# EAGLE design Small Whole House Power Meter STPM34 v0.6d routed (EAGLE 7.2.0)

## Sheet 1 of 2
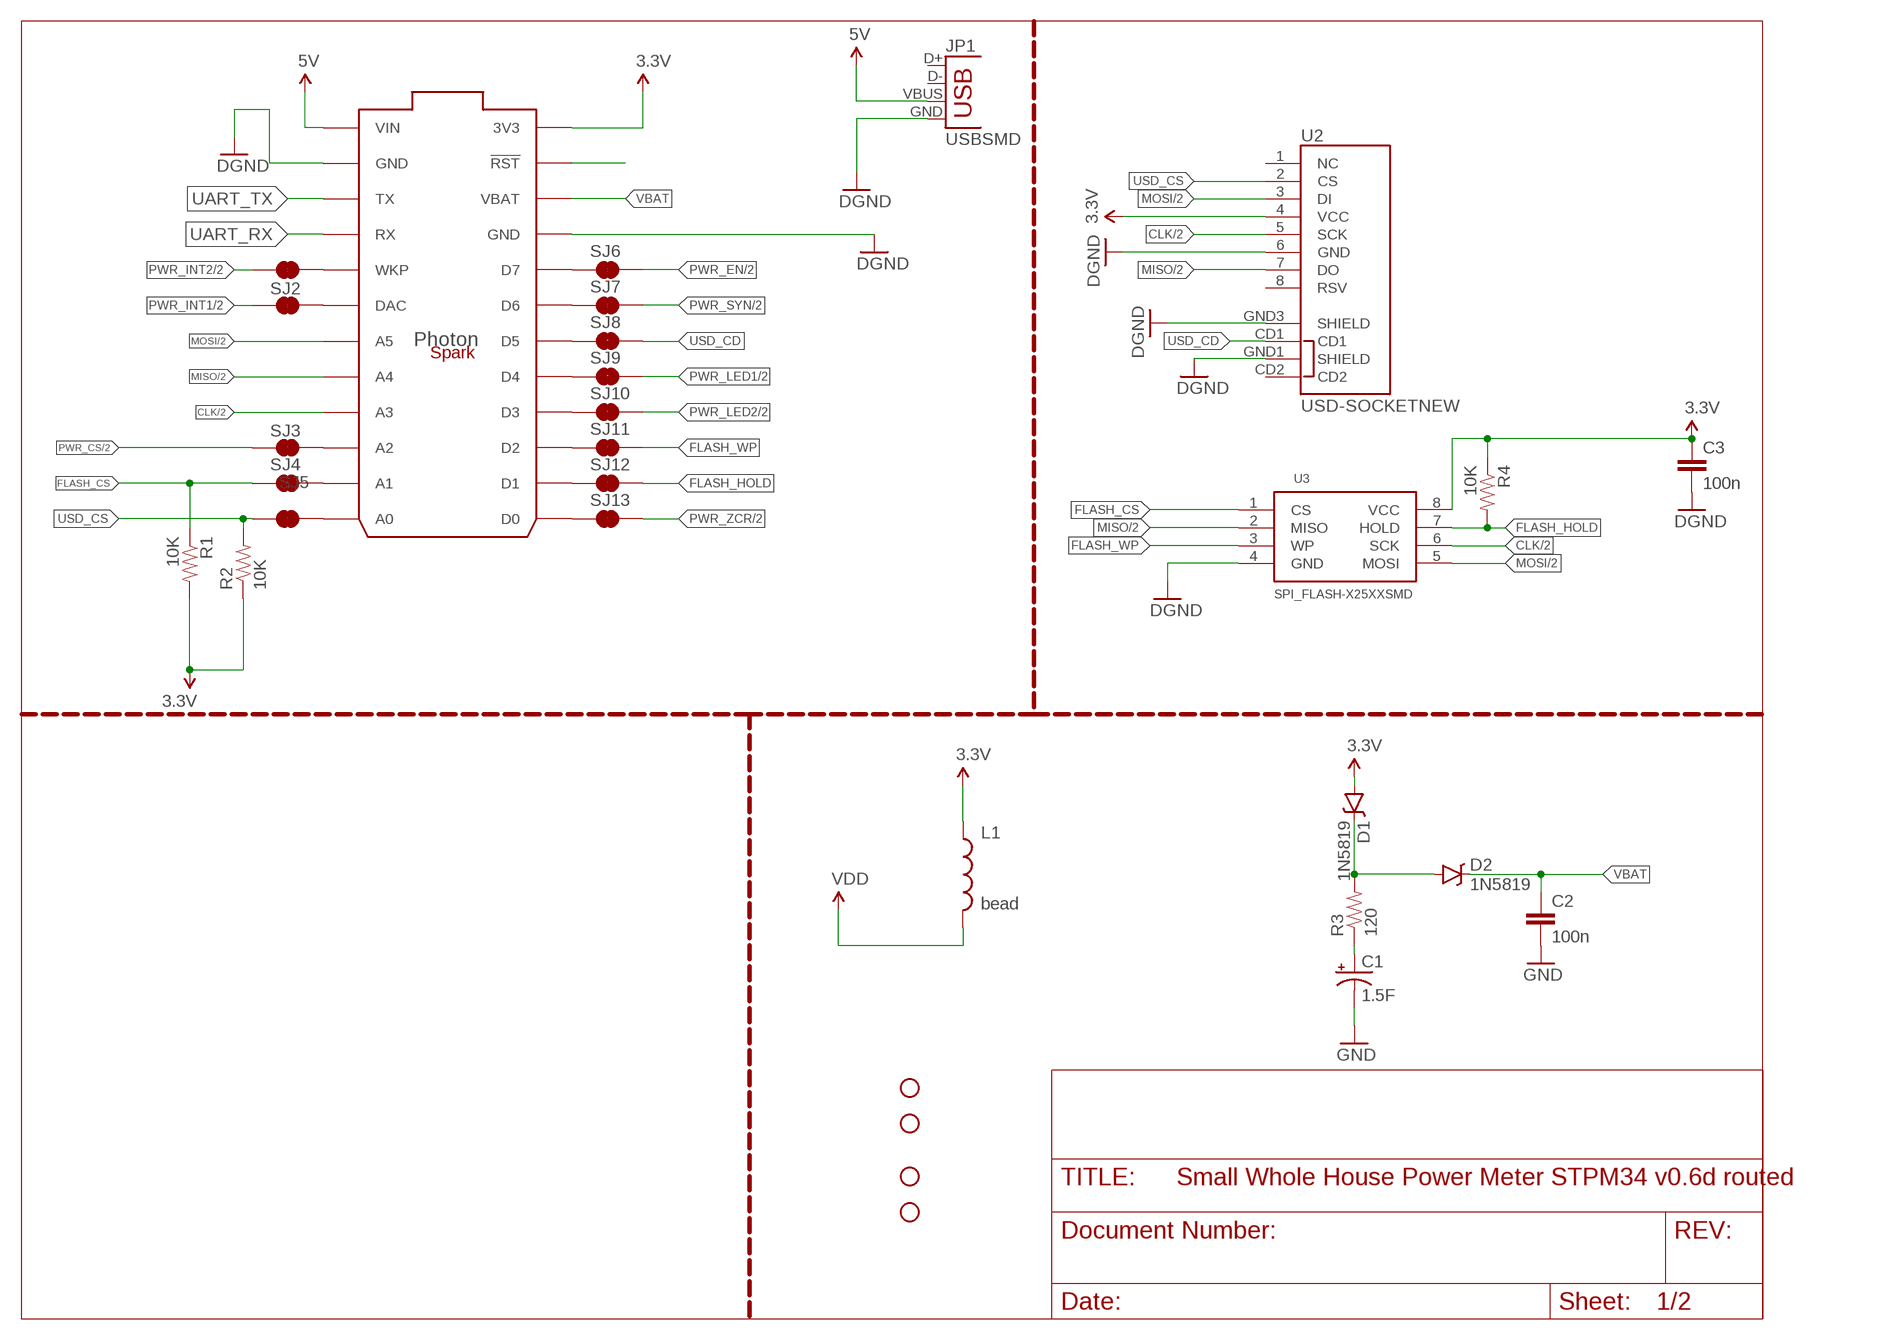
[diagram p0: schematic, sheet 1]

### Parts
C1  1.5F  CAP_POLSUPERHORIZ  [1.5SUPERCAPHORIZ]
C2  100n  CAP0603-CAP  [0603-CAP]
C3  100n  CAP0603-CAP  [0603-CAP]
D1  1N5819  DIODE-SCHOTTKY-SOD123  [SOD-123]
D2  1N5819  DIODE-SCHOTTKY-SOD123  [SOD-123]
JP1  USBSMD  [USB-MINIB]
L1  bead  INDUCTOR0603  [0603]
M1  SPARK_LOGO..  [SPARK_LOGO]
R1  10K  RESISTOR0603  [0603-RES]
R2  10K  RESISTOR0603  [0603-RES]
R3  120  RESISTOR0603  [0603-RES]
R4  10K  RESISTOR0603  [0603-RES]
SJ1  JUMPER-PAD-2-NC_BY_TRACE  [PAD-JUMPER-2-NC_BY_TRACE_YES_SILK]
SJ2  JUMPER-PAD-2-NC_BY_TRACE  [PAD-JUMPER-2-NC_BY_TRACE_YES_SILK]
SJ3  JUMPER-PAD-2-NC_BY_TRACE  [PAD-JUMPER-2-NC_BY_TRACE_YES_SILK]
SJ4  JUMPER-PAD-2-NC_BY_TRACE  [PAD-JUMPER-2-NC_BY_TRACE_YES_SILK]
SJ5  JUMPER-PAD-2-NC_BY_TRACE  [PAD-JUMPER-2-NC_BY_TRACE_YES_SILK]
SJ6  JUMPER-PAD-2-NC_BY_TRACE  [PAD-JUMPER-2-NC_BY_TRACE_YES_SILK]
SJ7  JUMPER-PAD-2-NC_BY_TRACE  [PAD-JUMPER-2-NC_BY_TRACE_YES_SILK]
SJ8  JUMPER-PAD-2-NC_BY_TRACE  [PAD-JUMPER-2-NC_BY_TRACE_YES_SILK]
SJ9  JUMPER-PAD-2-NC_BY_TRACE  [PAD-JUMPER-2-NC_BY_TRACE_YES_SILK]
SJ10  JUMPER-PAD-2-NC_BY_TRACE  [PAD-JUMPER-2-NC_BY_TRACE_YES_SILK]
SJ11  JUMPER-PAD-2-NC_BY_TRACE  [PAD-JUMPER-2-NC_BY_TRACE_YES_SILK]
SJ12  JUMPER-PAD-2-NC_BY_TRACE  [PAD-JUMPER-2-NC_BY_TRACE_YES_SILK]
SJ13  JUMPER-PAD-2-NC_BY_TRACE  [PAD-JUMPER-2-NC_BY_TRACE_YES_SILK]
STANDOFF1  STAND-OFF  [STAND-OFF]
STANDOFF2  STAND-OFF  [STAND-OFF]
STANDOFF3  STAND-OFF  [STAND-OFF]
STANDOFF4  STAND-OFF  [STAND-OFF]
U1  PHOTON_SMD_W_PINS  [PHOTON_SMD_W_PINS]
U2  USD-SOCKETNEW  [MICRO-SD-SOCKET-PP]
U3  SPI_FLASH-X25XXSMD  [SO08N/W]

### Nets
3.3V [Power]: C3.1 D1.A L1.1 R1.2 R2.1 R4.1 U1.1_24(3V3) U1.24(3V3) U1.24*(3V3) U1.24_(3V3) U2.4(VCC) U3.8(VCC)
5V [Power]: JP1.VBUS U1.1(VIN) U1.1*(VIN) U1.1_1(VIN) U1.1_(VIN)
CLK: U1.1_9(A3) U1.9(A3) U1.9*(A3) U1.9_(A3) U2.5(SCK) U3.6(SCK) ; also sheet 2
FLASH_CS: R1.1 SJ4.1 U3.1(CS)
FLASH_HOLD: R4.2 SJ12.2 U3.7(HOLD)
FLASH_WP: SJ11.2 U3.3(WP)
GND [Power]: C1.- C2.2 C3.2 JP1.GND U1.1_2(GND) U1.1_21(GND) U1.2(GND) U1.2*(GND) U1.2_(GND) U1.21(GND) U1.21*(GND) U1.21_(GND) U2.6(GND) U2.GND1(SHIELD) U2.GND3(SHIELD) U3.4(GND) ; supply symbol labelled DGND ; also sheet 2
MISO: U1.1_8(A4) U1.8(A4) U1.8*(A4) U1.8_(A4) U2.7(DO) U3.2(MISO) ; also sheet 2
MOSI: U1.1_7(A5) U1.7(A5) U1.7*(A5) U1.7_(A5) U2.3(DI) U3.5(MOSI) ; also sheet 2
N$3: SJ13.1 U1.1_13(D0) U1.13(D0) U1.13*(D0) U1.13_(D0)
N$20: U1.1_23(!RST) U1.23(!RST) U1.23*(!RST) U1.23_(!RST)
N$21 [Power]: C1.+ R3.1
N$22: SJ11.1 U1.1_15(D2) U1.15(D2) U1.15*(D2) U1.15_(D2)
N$23: SJ4.2 U1.1_11(A1) U1.11(A1) U1.11*(A1) U1.11_(A1)
N$25: SJ3.2 U1.1_10(A2) U1.10(A2) U1.10*(A2) U1.10_(A2)
N$27: SJ2.2 U1.1_6(DAC) U1.6(DAC) U1.6*(DAC) U1.6_(DAC)
N$28: SJ1.2 U1.1_5(WKP) U1.5(WKP) U1.5*(WKP) U1.5_(WKP)
N$29: SJ6.1 U1.1_20(D7) U1.20(D7) U1.20*(D7) U1.20_(D7)
N$30: SJ7.1 U1.1_19(D6) U1.19(D6) U1.19*(D6) U1.19_(D6)
N$31: SJ8.1 U1.1_18(D5) U1.18(D5) U1.18*(D5) U1.18_(D5)
N$32: SJ9.1 U1.1_17(D4) U1.17(D4) U1.17*(D4) U1.17_(D4)
N$34: SJ12.1 U1.1_14(D1) U1.14(D1) U1.14*(D1) U1.14_(D1)
N$35: SJ10.1 U1.1_16(D3) U1.16(D3) U1.16*(D3) U1.16_(D3)
N$37: D1.C D2.A R3.2
N$38: SJ5.2 U1.1_12(A0) U1.12(A0) U1.12*(A0) U1.12_(A0)
PWR_CS: SJ3.1 ; also sheet 2
PWR_EN: SJ6.2 ; also sheet 2
PWR_INT1: SJ2.1 ; also sheet 2
PWR_INT2: SJ1.1 ; also sheet 2
PWR_LED1: SJ9.2 ; also sheet 2
PWR_LED2: SJ10.2 ; also sheet 2
PWR_SYN: SJ7.2 ; also sheet 2
PWR_ZCR: SJ13.2 ; also sheet 2
UART_RX: U1.1_4(RX) U1.4(RX) U1.4*(RX) U1.4_(RX)
UART_TX: U1.1_3(TX) U1.3(TX) U1.3*(TX) U1.3_(TX)
USD_CD: SJ8.2 U2.CD1
USD_CS: R2.2 SJ5.1 U2.2(CS)
VBAT: C2.1 D2.C U1.1_22(VBAT) U1.22(VBAT) U1.22*(VBAT) U1.22_(VBAT)
VDD [Power]: L1.2 ; also sheet 2
Unconnected: JP1.D+ JP1.D- U2.1(NC) U2.8(RSV) U2.CD2

## Sheet 2 of 2
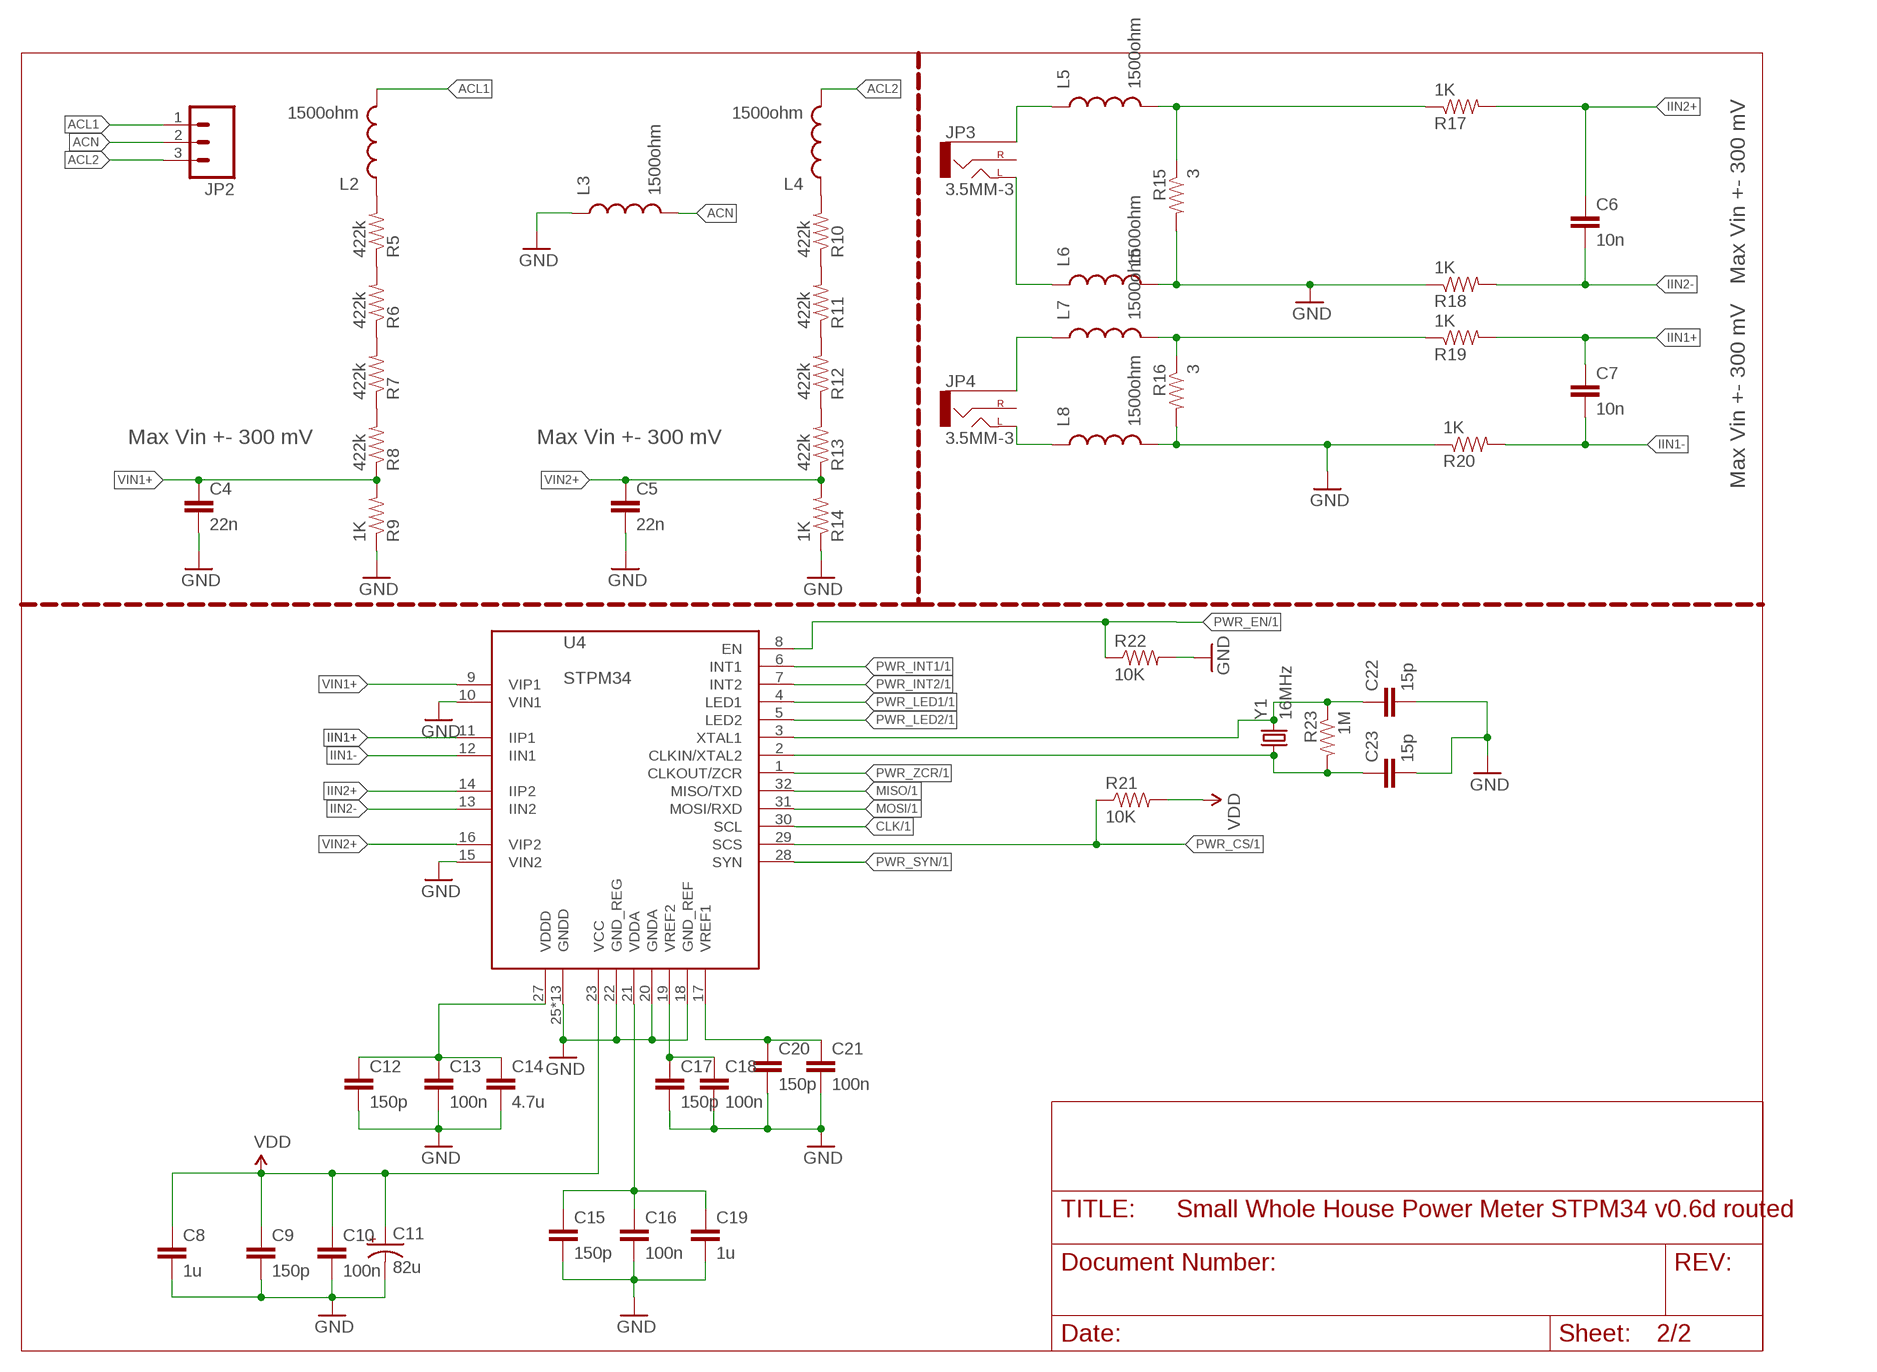
[diagram p1: schematic, sheet 2]

### Parts
C4  22n  CAP0603-CAP  [0603-CAP]
C5  22n  CAP0603-CAP  [0603-CAP]
C6  10n  CAP0603-CAP  [0603-CAP]
C7  10n  CAP0603-CAP  [0603-CAP]
C8  1u  CAP0603-CAP  [0603-CAP]
C9  150p  CAP0603-CAP  [0603-CAP]
C10  100n  CAP0603-CAP  [0603-CAP]
C11  82u  CAP_POLPTH2  [CPOL-RADIAL-10UF-25V]
C12  150p  CAP0603-CAP  [0603-CAP]
C13  100n  CAP0603-CAP  [0603-CAP]
C14  4.7u  CAP0805  [0805]
C15  150p  CAP0603-CAP  [0603-CAP]
C16  100n  CAP0603-CAP  [0603-CAP]
C17  150p  CAP0603-CAP  [0603-CAP]
C18  100n  CAP0603-CAP  [0603-CAP]
C19  1u  CAP0603-CAP  [0603-CAP]
C20  150p  CAP0603-CAP  [0603-CAP]
C21  100n  CAP0603-CAP  [0603-CAP]
C22  15p  CAP0603-CAP  [0603-CAP]
C23  15p  CAP0603-CAP  [0603-CAP]
JP2  M03-SCREW-5MM  [SCREWTERMINAL-5MM-3]
JP3  3.5MM-3  AUDIO-JACKPTH  [AUDIO-JACK]
JP4  3.5MM-3  AUDIO-JACKPTH  [AUDIO-JACK]
L2  1500ohm  INDUCTOR-SPARKFUN0603  [0603]
L3  1500ohm  INDUCTOR-SPARKFUN0603  [0603]
L4  1500ohm  INDUCTOR-SPARKFUN0603  [0603]
L5  1500ohm  INDUCTOR-SPARKFUN0603  [0603]
L6  1500ohm  INDUCTOR-SPARKFUN0603  [0603]
L7  1500ohm  INDUCTOR-SPARKFUN0603  [0603]
L8  1500ohm  INDUCTOR-SPARKFUN0603  [0603]
R5  422k  RESISTOR1206  [1206]
R6  422k  RESISTOR1206  [1206]
R7  422k  RESISTOR1206  [1206]
R8  422k  RESISTOR1206  [1206]
R9  1K  RESISTOR0603-RES  [0603-RES]
R10  422k  RESISTOR1206  [1206]
R11  422k  RESISTOR1206  [1206]
R12  422k  RESISTOR1206  [1206]
R13  422k  RESISTOR1206  [1206]
R14  1K  RESISTOR0603-RES  [0603-RES]
R15  3  RESISTOR0805-RES  [0805]
R16  3  RESISTOR0805-RES  [0805]
R17  1K  RESISTOR0603-RES  [0603-RES]
R18  1K  RESISTOR0603-RES  [0603-RES]
R19  1K  RESISTOR0603-RES  [0603-RES]
R20  1K  RESISTOR0603-RES  [0603-RES]
R21  10K  RESISTOR0603  [0603-RES]
R22  10K  RESISTOR0603  [0603-RES]
R23  1M  RESISTOR0603-RES  [0603-RES]
U4  STPM34  [UFQFPN32]
Y1  16MHz  CRYSTALHC49US  [HC49US]

### Nets
ACL1 [AC]: JP2.1 L2.2
ACL2 [AC]: JP2.3 L4.2
ACN: JP2.2 L3.2
CLK: U4.30(SCL) ; also sheet 1
CUR_TRAN1+: L7.2 R16.1 R19.1
CUR_TRAN2+: L5.2 R15.1 R17.1
GND [Power]: C4.2 C5.2 C8.2 C9.2 C10.2 C11.2(-) C12.2 C13.2 C14.2 C15.2 C16.2 C17.2 C18.2 C19.2 C20.2 C21.2 C22.2 C23.2 L3.1 L6.2 L8.2 R9.1 R14.1 R15.2 R16.2 R18.1 R20.1 R22.2 U4.10(VIN1) U4.15(VIN2) U4.18(GND_REF) U4.20(GNDA) U4.22(GND_REG) U4.25(GNDD) U4.26(GNDD) U4.EXP1(GNDD) U4.EXP(GNDD) U4.P$1(GNDD) U4.P$2(GNDD) U4.P$3(GNDD) U4.P$4(GNDD) U4.P$5(GNDD) U4.P$6(GNDD) U4.P$7(GNDD) U4.P$8(GNDD) U4.P$9(GNDD) ; also sheet 1
IIN1+: C7.1 R19.2 U4.11(IIP1)
IIN1-: C7.2 R20.2 U4.12(IIN1)
IIN2+: C6.1 R17.2 U4.14(IIP2)
IIN2-: C6.2 R18.2 U4.13(IIN2)
MISO: U4.32(MISO/TXD) ; also sheet 1
MOSI: U4.31(MOSI/RXD) ; also sheet 1
N$1 [AC]: L2.1 R5.2
N$2 [AC]: L4.1 R10.2
N$4: C20.1 C21.1 U4.17(VREF1)
N$5: C23.1 R23.2 U4.2(CLKIN/XTAL2) Y1.1
N$6: C22.1 R23.1 U4.3(XTAL1) Y1.2
N$7: C15.1 C16.1 C19.1 U4.21(VDDA)
N$8 [AC]: R7.1 R8.2
N$9 [AC]: R6.1 R7.2
N$10 [AC]: R5.1 R6.2
N$11 [AC]: R12.1 R13.2
N$12 [AC]: R11.1 R12.2
N$13 [AC]: R10.1 R11.2
N$14: C17.1 C18.1 U4.19(VREF2)
N$15: JP4.TIP(LEFT) L8.1
N$16: JP3.TIP(LEFT) L6.1
N$17: JP3.SLEEVE L5.1
N$18: JP4.SLEEVE L7.1
N$19: C12.1 C13.1 C14.1 U4.27(VDDD)
PWR_CS: R21.1 U4.29(SCS) ; also sheet 1
PWR_EN: R22.1 U4.8(EN) ; also sheet 1
PWR_INT1: U4.6(INT1) ; also sheet 1
PWR_INT2: U4.7(INT2) ; also sheet 1
PWR_LED1: U4.4(LED1) ; also sheet 1
PWR_LED2: U4.5(LED2) ; also sheet 1
PWR_SYN: U4.28(SYN) ; also sheet 1
PWR_ZCR: U4.1(CLKOUT/ZCR) ; also sheet 1
VDD [Power]: C8.1 C9.1 C10.1 C11.1(+) R21.2 U4.23(VCC) ; also sheet 1
VIN1+: C4.1 R8.1 R9.2 U4.9(VIP1)
VIN2+: C5.1 R13.1 R14.2 U4.16(VIP2)
Unconnected: JP3.RING(RIGHT) JP4.RING(RIGHT)

### Notes on the sheet
- Max Vin +- 300 mV
- Max Vin +- 300 mV | Max Vin +- 300 mV
- Max Vin +- 300 mV

## Library data of the parts
C1 = project library:CAP_POL: Capacitor Polarized These are standard SMD and PTH capacitors. Normally 10uF, 47uF, and 100uF in electrolytic and tantalum varieties. Always verify the external diameter of the through hole cap, it varies with capacity, voltage, and manufacturer. The EIA devices should be standard.
C2-C10 C12-C23 = SparkFun-Capacitors:CAP: Capacitor Standard 0603 ceramic capacitor, and 0.1" leaded capacitor.
C11 = mylibrary:CAP_POL: Capacitor Polarized These are standard SMD and PTH capacitors. Normally 10uF, 47uF, and 100uF in electrolytic and tantalum varieties. Always verify the external diameter of the through hole cap, it varies with capacity, voltage, and manufacturer. The EIA devices should be standard.
D1 D2 = project library:DIODE-SCHOTTKY: Schottky diodes in SFE's production catalog BAT20J 1A 23V 0.62Vf RB751 120mA 40V 0.37Vf PMEG4005EJ 0.5A 40V 0.42Vf MBRA140 1A 40V 0.5Vf B340A 3A 40V SMA
JP1 = SparkFun-Connectors:USB: USB Connectors USB-B-PTH is fully proven SKU : PRT-00139/CONN-08278 USB-miniB is fully proven SKU : PRT-00587 USB-A-PCB is untested. USB-A-H is throughly reviewed, but untested. Spark Fun Electronics SKU : PRT-00437 USB-B-SMT is throughly reviewed, but untested. Needs silkscreen touching up. USB-A-S has not been used/tested USB-MB-H has not been used/tested USB-MICROB has been used. CONN-09505; PROD_ID: CONN-08193
JP2 = SparkFun-Connectors:M03: Header 3 Standard 3-pin 0.1" header. Use with straight break away headers (SKU : PRT-00116), right angle break away headers (PRT-00553), swiss pins (PRT-00743), machine pins (PRT-00117), and female headers (PRT-00115). Molex polarized connector foot print use with SKU : PRT-08232 with associated crimp pins and housings.
JP3 JP4 = SparkFun-Connectors:AUDIO-JACK: 3.5mm Audio Jack Simple 3.5mm common PCB mount audio jack. Variant PTH is our storefront SKU PRT-08032
L1 = SparkFun-Passives:INDUCTOR: Inductors Basic Inductor/Choke - 0603 and 1206. Footprints are not proven and vary greatly between part numbers. SRN6045- 33uH, 20% 1.4A SDR0403-560KL - 56uH, 10%, 500mA RMS/740mA peak
L2-L8 = Spark:INDUCTOR-SPARKFUN: Inductors Basic Inductor/Choke - 0603 and 1206. Footprints are not proven and vary greatly between part numbers. SRN6045- 33uH, 20% 1.4A
M1 = mylibrary:SPARK_LOGO
R1-R23 = SparkFun-Resistors:RESISTOR: Resistor Basic schematic elements and footprints for 0603, 1206, and PTH resistors.
SJ1-SJ13 = SparkFun-Passives:JUMPER-PAD-2-NC_BY_TRACE
STANDOFF1-STANDOFF4 = SparkFun-Electromechanical:STAND-OFF: #4 Stand Off This is the mechanical footprint for a #4 phillips button head screw. Use the keepout ring to avoid running the screw head into surrounding components. SKU : PRT-00447
U1 = mylibrary:PHOTON_SMD_W_PINS: Photon (without headers) - designed to be surface mounted with 7 extra exposed pads on the bottom of the board which include, 3 RGB LED outputs, /SETUP, EN (3.3V SMPS enable input), USB D+ and USB D-.
U2 = SparkFun-Connectors:USD-SOCKET: microSD Socket Push-push type uSD socket. Schematic element and footprint production proven. Spark Fun Electronics SKU : PRT-00127. tDoc lines correctly indicate media card edge positions when inserting (unlocked, locked, depressed). NOTE: CD1 and CD2 are connected internally; PROD_ID: CONN-07820
U3 = project library:SPI_FLASH-X25XX: 8pin SPI Flash series x25xx. Works with devices like W25X32 and BR25L32
U4 = project library:STPM34
Y1 = SparkFun-FreqCtrl:CRYSTAL: Various standard crystals. Proven footprints. Spark Fun Electronics SKU : COM-00534

## Net classes
0 default: width 0.191 mm, clearance 0.152 mm
1 AC: width 0.254 mm, clearance 0.559 mm
2 Power: width 0.254 mm, clearance 0.152 mm

## Board
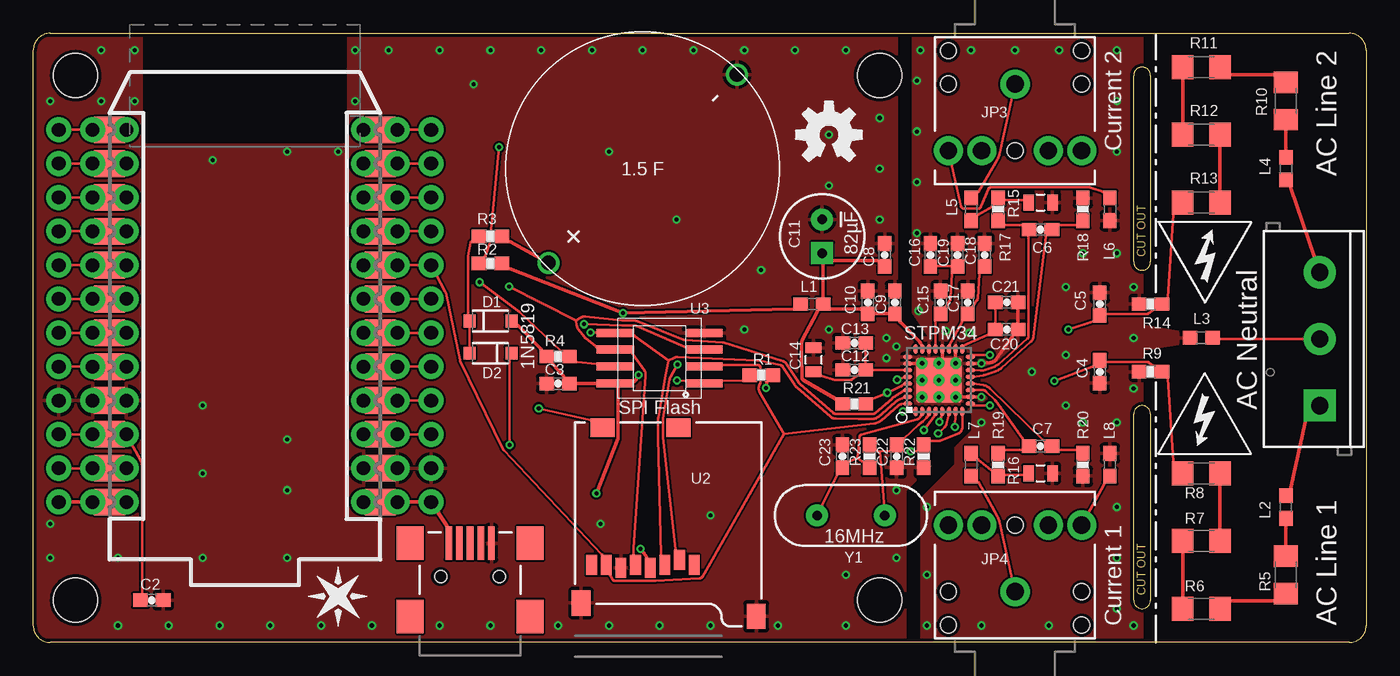
[diagram p2: board, top side]
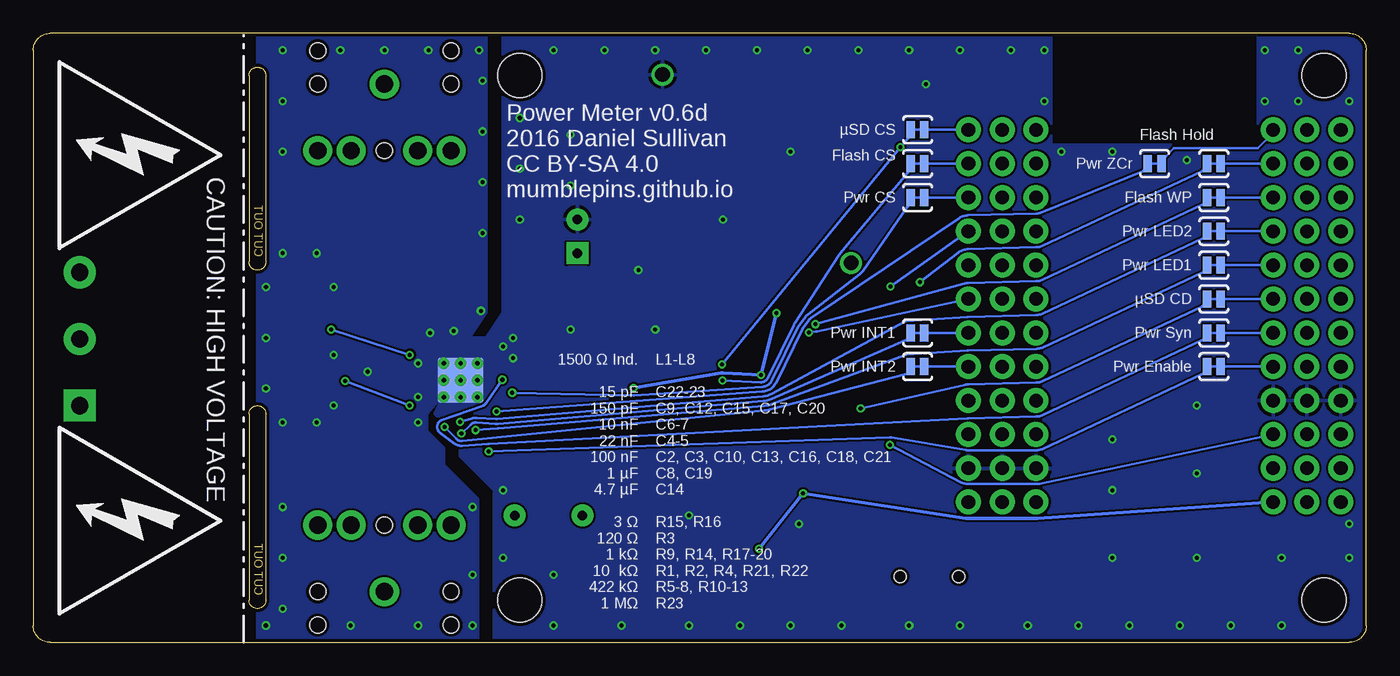
[diagram p3: board, bottom side, seen from below]

Size 100 x 45.72 mm. Coordinates in mm from the lower left corner, seen from the top.
Outline: 0,1.27 0,44.45 arc-90 1.27,45.72 98.73,45.72 arc-90 100,44.45 100,1.27 arc-90 98.73,0 1.27,0 arc-90 0,1.27
Outline: 83.82,17.14 83.82,3.17 arc-90 83.19,2.54 arc-90 82.55,3.17 82.55,17.14 arc-90 83.19,17.78 arc-90 83.82,17.14
Outline: 83.82,42.55 83.82,28.57 arc-90 83.19,27.94 arc-90 82.55,28.57 82.55,42.55 arc-90 83.19,43.18 arc-90 83.82,42.55
Copper layers (1*16): TOP 0.035mm / dielectric 1.5mm / BOTTOM 0.035mm
Design rules "ITead_rule": minimum track width 6mil, minimum drill 12mil, track to track 6mil, track to pad 6mil, pad to pad 6mil, via to via 6mil, smd to smd 0mil, copper to edge 10mil, drill to drill 10mil, minimum pad ring 10mil, minimum via ring 6mil, stop-mask expansion 2mil, vias tented up to drill 100mil, thermal gap 10mil
tRestrict: area 8.3,37.5 to 23.5,46.4
bRestrict: area 8.3,37.5 to 23.5,46.4

### Footprints (pad centres in the part's own frame; a part is rotated, then mirrored left to right if it is on the bottom)
1.5SUPERCAPHORIZ = drill 1.1: + 10,0; - -10,0
0603-CAP = smd 1.1 x 1: 1 -0.85,0; 2 0.85,0
CPOL-RADIAL-10UF-25V = drill 0.7 pad 1.651 square: 1 1.27,0 | drill 0.7 pad 1.651: 2 -1.27,0
0805 = smd 0.8 x 1.2: 1 -0.9,0; 2 0.9,0
SOD-123 = smd 0.9 x 0.95: A 1.575,0; C -1.575,0
USB-MINIB = smd 2.5 x 0.5: D+ 2.5,0; D- 2.5,0.8; GND 2.5,-1.6; ID 2.5,-0.8; VBUS 2.5,1.6 | smd 2.5 x 2: MTN1 -3,4.5; MTN2 2.5,4.5; MTN3 -3,-4.5; MTN4 2.5,-4.5 | hole 0.9: 0,-2.2; 0,2.2
SCREWTERMINAL-5MM-3 = drill 1.3 pad 2.413 square: 1 0,0 | drill 1.3 pad 2.413: 2 5,0; 3 10,0
AUDIO-JACK = drill 1.3 pad 2.184: RING 5,5; RSH 5,2.5; SLEEVE 0,0; TIP 5,-5; TSH 5,-2.5 | hole 1.2: 5,0; 0,-5; -2.5,-5; -2.5,5; 0,5
0603 = smd 1.1 x 1: 1 -0.85,0; 2 0.85,0
0603-RES = smd 1.1 x 1: 1 -0.85,0; 2 0.85,0
1206 = smd 1.6 x 1.8: 1 -1.4,0; 2 1.4,0
PAD-JUMPER-2-NC_BY_TRACE_YES_SILK = smd 0.635 x 1.27: 1 -0.508,0; 2 0.508,0
STAND-OFF = hole 3.302: 0,0
PHOTON_SMD_W_PINS = smd 2.54 x 2.032: 1 0,32.258; 2 0,29.718; 3 0,27.178; 4 0,24.638; 5 0,22.098; 6 0,19.558; 7 0,17.018; 8 0,14.478; 9 0,11.938; 10 0,9.398; 11 0,6.858; 12 0,4.318; 13 20.32,4.318; 14 20.32,6.858; 15 20.32,9.398; 16 20.32,11.938; 17 20.32,14.478; 18 20.32,17.018; 19 20.32,19.558; 20 20.32,22.098; 21 20.32,24.638; 22 20.32,27.178; 23 20.32,29.718; 24 20.32,32.258 | drill 1.016 pad 1.88: 1* -1.27,32.258; 1_ 1.27,32.258; 1_1 -3.81,32.258; 1_2 -3.81,29.718; 1_3 -3.81,27.178; 1_4 -3.81,24.638; 1_5 -3.81,22.098; 1_6 -3.81,19.558; 1_7 -3.81,17.018; 1_8 -3.81,14.478; 1_9 -3.81,11.938; 1_10 -3.81,9.398; 1_11 -3.81,6.858; 1_12 -3.81,4.318; 1_13 24.13,4.318; 1_14 24.13,6.858; 1_15 24.13,9.398; 1_16 24.13,11.938; 1_17 24.13,14.478; 1_18 24.13,17.018; 1_19 24.13,19.558; 1_20 24.13,22.098; 1_21 24.13,24.638; 1_22 24.13,27.178; 1_23 24.13,29.718; 1_24 24.13,32.258; 2* -1.27,29.718; 2_ 1.27,29.718; 3* -1.27,27.178; 3_ 1.27,27.178; 4* -1.27,24.638; 4_ 1.27,24.638; 5* -1.27,22.098; 5_ 1.27,22.098; 6* -1.27,19.558; 6_ 1.27,19.558; 7* -1.27,17.018; 7_ 1.27,17.018; 8* -1.27,14.478; 8_ 1.27,14.478; 9* -1.27,11.938; 9_ 1.27,11.938; 10* -1.27,9.398; 10_ 1.27,9.398; 11* -1.27,6.858; 11_ 1.27,6.858; 12* -1.27,4.318; 12_ 1.27,4.318; 13* 21.59,4.318; 13_ 19.05,4.318; 14* 21.59,6.858; 14_ 19.05,6.858; 15* 21.59,9.398; 15_ 19.05,9.398; 16* 21.59,11.938; 16_ 19.05,11.938; 17* 21.59,14.478; 17_ 19.05,14.478; 18* 21.59,17.018; 18_ 19.05,17.018; 19* 21.59,19.558; 19_ 19.05,19.558; 20* 21.59,22.098; 20_ 19.05,22.098; 21* 21.59,24.638; 21_ 19.05,24.638; 22* 21.59,27.178; 22_ 19.05,27.178; 23* 21.59,29.718; 23_ 19.05,29.718; 24* 21.59,32.258; 24_ 19.05,32.258
MICRO-SD-SOCKET-PP = smd 0.8 x 1.5: 1 -8.94,10.7; 2 -7.84,10.3; 3 -6.74,10.7; 4 -5.64,10.9; 5 -4.54,10.7; 6 -3.44,10.9; 7 -2.34,10.7; 8 -1.24,10.7 | smd 1.8 x 1.4: CD1 -2.05,0.4; CD2 -7.75,0.4 | smd 1.4 x 1.9: GND1 -13.6,14.55; GND3 -0.45,13.55
SO08N/W = smd 0.6 x 2.8: 1 -1.905,-3.325; 2 -0.635,-3.325; 3 0.635,-3.325; 4 1.905,-3.325; 5 1.905,3.325; 6 0.635,3.325; 7 -0.635,3.325; 8 -1.905,3.325
UFQFPN32 = smd 0.7 x 0.3: 1 -2.35,1.75; 2 -2.35,1.25; 3 -2.35,0.75; 4 -2.35,0.25; 5 -2.35,-0.25; 6 -2.35,-0.75; 7 -2.35,-1.25; 8 -2.35,-1.75; 17 2.35,-1.75; 18 2.35,-1.25; 19 2.35,-0.75; 20 2.35,-0.25; 21 2.35,0.25; 22 2.35,0.75; 23 2.35,1.25; 24 2.35,1.75 | smd 0.3 x 0.7: 9 -1.75,-2.35; 10 -1.25,-2.35; 11 -0.75,-2.35; 12 -0.25,-2.35; 13 0.25,-2.35; 14 0.75,-2.35; 15 1.25,-2.35; 16 1.75,-2.35; 25 1.75,2.35; 26 1.25,2.35; 27 0.75,2.35; 28 0.25,2.35; 29 -0.25,2.35; 30 -0.75,2.35; 31 -1.25,2.35; 32 -1.75,2.35 | smd 3.4 x 3.4: EXP 0,0 | smd 3.4 x 3.4 bottom: EXP1 0,0 | drill 0.33: P$1 -1.27,1.27; P$2 0,1.27; P$3 1.27,1.27; P$4 1.27,0; P$5 0,0; P$6 -1.27,0; P$7 -1.27,-1.27; P$8 0,-1.27; P$9 1.27,-1.27
HC49US = drill 0.7 pad 1.651: 1 -2.54,0; 2 2.54,0

### Placement (x,y rotation side)
C1  45.72,35.56 225 top
C2  8.89,3.17 0 top
C3  39.37,19.43 180 top
C4  80.01,20.32 270 top
C5  80.01,25.4 90 top
C6  75.56,30.99 0 top
C7  75.56,14.73 0 top
C8  63.88,29.08 90 top
C9  64.64,25.53 90 top
C10  62.61,25.53 90 top
C11  59.18,30.48 270 top
C12  61.59,20.45 180 top
C13  61.59,22.48 180 top
C14  58.55,21.21 90 top
C15  68.07,25.53 90 top
C16  67.31,29.08 90 top
C17  70.1,25.53 90 top
C18  71.37,29.08 90 top
C19  69.34,29.08 90 top
C20  73.03,23.5 0 top
C21  73.03,25.53 0 top
C22  64.77,13.97 270 top
C23  60.71,13.97 90 top
D1  34.29,24.13 0 top
D2  34.29,21.72 180 top
E$1  [HIGH_VOLTAGE]  93.34,36.58 270 bottom
E$2  [HIGH_VOLTAGE_HALF]  87.88,29.21 180 top
E$3  [HIGH_VOLTAGE_HALF]  87.88,16.51 0 top
E$4  [OSHW-LOGO-M]  59.69,38.1 0 top
E$5  [HIGH_VOLTAGE]  93.34,9.14 270 bottom
JP1  32.77,4.95 90 top
JP2  96.52,17.78 90 top
JP3  73.66,41.91 270 top
JP4  73.66,3.81 90 top
L1  58.42,25.4 0 top
L2  93.98,10.16 90 top
L3  87.63,22.86 0 top
L4  93.98,35.56 270 top
L5  70.36,32.51 270 top
L6  80.77,32.51 270 top
L7  70.36,13.34 90 top
L8  80.77,13.34 90 top
M1  20.57,1.14 0 top
R1  54.61,20.07 0 top
R2  34.29,28.45 180 top
R3  34.29,30.48 180 top
R4  39.37,21.46 0 top
R5  93.98,5.08 90 top
R6  87.63,2.54 0 top
R7  87.63,7.62 180 top
R8  87.63,12.7 0 top
R9  83.82,20.32 0 top
R10  93.98,40.64 270 top
R11  87.63,43.18 0 top
R12  87.63,38.1 180 top
R13  87.63,33.02 0 top
R14  83.82,25.4 0 top
R15  75.56,33.02 0 top
R16  75.56,12.7 0 top
R17  72.39,32.51 270 top
R18  78.74,32.51 270 top
R19  72.39,13.34 90 top
R20  78.74,13.34 90 top
R21  61.59,17.91 180 top
R22  66.8,13.97 270 top
R23  62.74,13.97 270 top
SJ1  33.66,20.7 0 bottom
SJ2  33.66,23.24 0 bottom
SJ3  33.66,33.4 0 bottom
SJ4  33.66,35.94 0 bottom
SJ5  33.66,38.48 0 bottom
SJ6  11.43,20.7 180 bottom
SJ7  11.43,23.24 180 bottom
SJ8  11.43,25.78 180 bottom
SJ9  11.43,28.32 180 bottom
SJ10  11.43,30.86 180 bottom
SJ11  11.43,33.4 180 bottom
SJ12  11.43,35.94 180 bottom
SJ13  15.88,35.94 180 bottom
STANDOFF1  3.17,42.55 0 top
STANDOFF2  3.17,3.17 0 top
STANDOFF3  63.5,3.17 0 top
STANDOFF4  63.5,42.55 0 top
U1  26.04,42.8 180 top
U2  40.64,16.51 180 top
U3  46.99,21.34 90 top
U4  67.94,19.68 90 top
Y1  61.34,9.53 0 top

### Tracks (layer width: path | path; a pad name or v marks a point on that pad's centre or on a via)
3.3V  (via drill 0.3 pad 0.61)
  TOP 0.254: v42.24,11.18 43.85,15.31 arc21 43.87,15.41 43.87,19.13 43.87,19.26 U3.8 | U3.8 42.39,19.43 42.27,19.43 40.77,19.43 40.64,19.43 C3.1 39.8,19.8 39.8,19.93 arc42 39.76,20.02 38.98,20.88 arc-42 38.94,20.96 38.94,21.09 R4.1 38.1,21.84 38.1,21.96 arc44 38.06,22.05 36.41,23.74 arc46 36.31,23.78 36.19,23.78 D1.A | U1.24_ 6.78,10.54 U1.24 4.65,10.54 U1.24* U1.1_24 | U2.4 46.01,6.23 46.01,6.36 arc31 45.99,6.43 45.82,6.71 arc8 45.8,6.74 v45.57,7.02 | R1.2 55.04,19.69 55.04,19.57 v54.97,19.09 | U3.8 44.94,19.6 45.06,19.6 arc62 45.18,19.67 v45.4,20.08 | L1.1 57.15,25.03 57.02,25.03 v44.24,24.71 35.74,28.07 arc22 35.69,28.07 35.56,28.07 R2.1
  BOTTOM 0.254: U1.24_ 24.68,9.3 arc4 24.77,9.3 29.84,9.3 arc9 30.03,9.31 v42.24,11.18 v45.57,7.02 | v44.24,24.71 v45.4,20.08 48.26,20.23 arc-13 48.39,20.23 v54.97,19.09
5V
  TOP 0.254: U1.1_ 24.97,10.54 U1.1 27.1,10.54 U1.1* U1.1_1 31.02,8.77 arc-34 31.04,8.7 31.04,8.58 JP1.VBUS
ACL1
  TOP 0.254: L2.2 94.35,11.43 94.35,11.56 arc-12 94.36,11.59 95.44,16.55 arc12 95.44,16.57 95.44,16.7 JP2.1
ACL2
  TOP 0.254: L4.2 94.35,34.29 94.35,34.16 arc19 94.36,34.12 JP2.3
ACN
  TOP 0.191: L3.2 88.94,22.78 89.03,22.78 JP2.2
CLK  (via drill 0.3 pad 0.61)
  TOP 0.191: v35.69,26.71 40.71,24.16 | U1.9_ 24.97,30.86 U1.9 27.1,30.86 U1.9* U1.1_9 | 40.71,24.16 40.77,23.8 arc29 40.88,23.54 41.34,22.93 arc13 41.44,22.83 42.2,22.2 arc40 42.27,22.18 42.36,22.18 U3.6 44.97,21.77 44.97,21.67 arc35 44.99,21.62 45.85,20.4 arc-39 45.95,20.04 45.01,7.06 arc4 45.01,7.02 45.01,6.56 45.01,6.46 U2.5 | U4.30 65.39,18.93 64.57,18.41 arc9 64.41,18.29 63.17,17.21 arc-41 62.99,17.15 61.9,17.15 61.89,17.15 60.19,17.16 arc-41 60.03,17.22 57.52,19.41 arc-16 57.4,19.55 56.52,20.9 arc39 56.19,21.14 51.79,22.52 arc14 51.73,22.53 48.9,22.69 arc-18 48.82,22.71 45.29,24.11 arc22 45.06,24.16 44.97,24.16 | 44.97,24.16 | 44.97,24.16 44.24,24.16 arc-6 44.19,24.16 41.38,24.45 arc39 41.02,24.36 40.71,24.16
  BOTTOM 0.191: U1.1_9 v35.69,26.71
CUR_TRAN1+
  TOP 0.191: L7.2 70.76,13.73 70.86,13.73 arc-39 70.92,13.71 71.83,12.96 arc39 71.89,12.94 71.98,12.94 R19.1 72.8,12.59 72.89,12.59 74.27,12.59 74.36,12.59 R16.1
CUR_TRAN2+
  TOP 0.191: L5.2 70.76,32.12 70.86,32.12 arc30 70.91,32.13 71.16,32.27 71.17,32.28 71.94,32.73 arc60 71.98,32.81 71.98,32.91 R17.1 72.8,33.19 72.89,33.19 74.27,33.19 74.36,33.19 R15.1
FLASH_CS  (via drill 0.3 pad 0.61)
  TOP 0.191: v48.29,19.65 48.91,19.64 49.01,19.64 U3.1 51.62,19.64 51.72,19.64 53.21,19.66 53.3,19.66 R1.1
  BOTTOM 0.191: SJ4.1 34.38,35.4 34.38,35.31 arc40 34.41,35.24 39.47,29.18 arc-7 39.55,29.07 42.87,23.96 arc-7 42.94,23.83 44.9,19.84 arc66 45.42,19.53 v48.29,19.65
FLASH_HOLD  (via drill 0.3 pad 0.61)
  TOP 0.191: U3.7 42.36,20.91 42.27,20.91 42.26,20.91 40.78,21.06 40.77,21.06 40.67,21.06 R4.2 39.77,21.87 39.67,21.87 arc-43 39.6,21.89 36.48,24.79 arc6 36.46,24.8 v33.47,27.04
  BOTTOM 0.191: SJ12.2 12.16,35.4 12.26,35.4 arc-25 12.3,35.39 24.25,29.77 arc24 24.73,29.66 29.88,29.52 arc-36 30.58,29.27 v33.47,27.04
FLASH_WP  (via drill 0.3 pad 0.61)
  TOP 0.191: v41.33,23.89 44.22,23.8 arc2 44.24,23.8 45.06,23.8 arc-23 45.17,23.78 48.88,22.18 arc23 48.91,22.18 49.01,22.18 U3.3
  BOTTOM 0.191: SJ11.2 12.16,32.86 12.26,32.86 arc-25 12.3,32.85 24.25,27.23 arc24 24.73,27.12 29.88,26.98 arc-14 30.16,26.94 v41.33,23.89
GND  (via drill 0.3, 0.3 pad 0.61)
  TOP 0.254: v71.12,18.41 70.31,18.41 U4.10 69.22,18.43 U4.P$7 | U4.15 70.31,20.95 v71.12,20.95 71.8,21.01 arc50 72.23,21.25 73.43,22.92 arc36 73.45,23 73.45,23.12 C20.2 C21.2 | U4.18 69.19,20.95 U4.P$9 U4.P$4 68.19,20.95 U4.20 | U4.26 65.59,20.95 U4.P$3 U4.P$1
  other vias: 50.8,9.53 42.55,8.89 64.77,22.23 59.69,23.5 53.34,23.5 82.55,22.86 6.35,1.27 10.16,1.27 13.97,1.27 17.78,1.27 21.59,1.27 25.4,1.27 30.48,1.27 34.29,1.27 39.37,1.27 43.18,1.27 46.99,1.27 50.8,1.27 55.88,1.27 60.96,1.27 60.96,5.08 64.77,6.35 64.77,11.43 63.5,31.75 63.5,35.56 63.5,39.37 60.96,44.45 57.15,44.45 53.34,44.45 49.53,44.45 45.72,44.45 41.91,44.45 38.1,44.45 34.29,44.45 30.48,44.45 26.67,44.45 24.13,44.45 24.13,40.64 22.86,36.83 19.05,36.83 13.46,36.2 7.62,40.64 7.62,44.45 5.08,44.45 5.08,40.64 1.27,40.64 1.27,8.89 1.27,6.35 6.35,6.35 67.06,1.27 67.06,5.08 67.06,10.16 71.12,16.51 70.23,23.24 66.42,24.89 66.29,30.73 66.29,34.54 66.29,38.35 66.29,42.16 66.55,44.45 70.36,44.45 73.66,44.45 76.96,44.45 81.28,44.45 81.28,40.64 81.28,36.83 81.28,29.21 82.55,26.67 82.55,19.05 81.28,16.51 81.28,10.16 81.28,6.35 81.28,2.54 82.55,1.27 76.2,1.27 71.12,1.27 64.01,22.86 64.01,21.34 68.45,23.37 59.69,34.29 12.7,17.78 12.7,12.7 12.7,6.35 19.05,6.35 19.05,11.43 19.05,15.24 43.18,36.83 33.02,41.91 48.26,31.75 54.61,27.94 59.69,38.1 77.47,26.67 77.47,21.59 74.93,20.32 77.47,17.78 78.74,16.51 78.74,29.21
  pour TOP: 66.67,-1.27 66.67,10.79 69.22,13.34 69.22,14.61 70.48,15.88 70.48,17.14 67.31,20.95 67.31,22.86 66.04,24.77 66.04,46.35 83.19,46.35 83.19,23.75 86.87,23.11 86.87,22.61 83.19,21.97 83.19,-1.27
  pour TOP: 65.41,-1.27 65.41,11.43 67.94,13.97 67.94,14.61 67.94,15.24 69.85,17.14 67.31,22.86 66.04,22.86 64.77,24.77 64.77,30.48 64.77,49.53 -5.08,49.53 -5.08,-1.27
  pour BOTTOM: 66.67,-0.64 66.67,10.79 69.22,13.34 69.22,14.61 70.48,15.88 70.48,17.14 67.31,20.95 67.31,22.86 66.04,24.77 66.04,46.35 83.19,46.35 83.19,-1.27 66.67,-1.27
  pour BOTTOM: 65.41,-1.27 65.41,11.43 67.94,13.97 67.94,14.61 67.94,15.24 69.85,17.14 67.31,22.86 66.04,22.86 64.77,24.77 64.77,30.48 64.77,49.53 -5.08,49.53 -5.08,-1.27
IIN1+
  TOP 0.191: U4.11 70.5,18.93 71.09,18.97 arc-47 71.5,18.81 72.15,18.19 arc-10 72.21,18.11 74.24,15.29 arc-36 74.26,15.23 74.26,15.14 C7.1 74.26,14.46 74.17,14.46 72.89,14.46 72.8,14.46 R19.2
IIN1-
  TOP 0.191: R20.2 78.33,14.46 78.24,14.46 76.97,14.46 76.87,14.46 C7.2 75.96,15.14 75.86,15.14 arc-44 75.8,15.16 71.75,19.07 arc35 71.26,19.31 70.5,19.43 U4.12
IIN2+
  TOP 0.191: U4.14 70.5,20.43 71.09,20.4 arc21 71.29,20.43 72.05,20.68 arc23 72.39,20.87 74.59,22.81 arc49 74.67,23 74.67,30.49 74.67,30.58 C6.1 74.26,31.32 74.17,31.32 72.89,31.32 72.8,31.32 R17.2
IIN2-
  TOP 0.191: U4.13 70.5,19.93 71.26,20.06 arc9 71.4,20.09 72.16,20.34 arc23 72.62,20.6 74.83,22.54 arc42 75.03,22.92 75.96,30.48 arc7 75.96,30.49 75.96,30.58 C6.2 76.87,31.32 76.97,31.32 78.24,31.32 78.33,31.32 R18.2
MISO
  TOP 0.191: U3.2 51.62,20.83 51.72,20.83 54.31,20.83 arc-90 54.57,20.57 54.57,19.57 arc-30 54.54,19.44 54.49,19.36 arc60 54.5,18.81 56.33,15.65 | U4.32 65.39,17.93 65.14,17.89 arc31 64.88,17.76 63.64,16.67 arc-35 63.11,16.44 56.33,15.65 | U1.8_ 24.97,28.32 U1.8 27.1,28.32 U1.8* U1.1_8 30.9,26.35 arc-17 31.02,26.02 32.01,21.19 arc14 32.03,21.13 35.22,14.57 arc17 35.32,14.43 42.65,6.62 arc-43 42.67,6.56 42.67,6.46 U2.7 43.28,5.16 43.28,5.06 arc31 43.3,5.01 43.47,4.73 arc59 43.68,4.61 46.68,4.61 arc3 46.7,4.61 49.99,4.81 arc57 50.2,4.94 56.33,15.65
MOSI  (via drill 0.3 pad 0.61)
  TOP 0.191: U1.7_ 24.97,25.78 U1.7 27.1,25.78 U1.7* U1.1_7 | U4.31 65.39,18.43 64.84,18.16 arc15 64.64,18.03 63.4,16.94 arc-41 62.99,16.79 61.9,16.79 61.89,16.79 60.19,16.8 arc-41 59.8,16.95 57.28,19.15 arc-16 57.1,19.35 56.22,20.7 arc44 56.06,20.81 54.44,21.17 arc10 54.34,21.18 48.34,21.42 arc29 48.07,21.36 47.67,21.16 | 47.67,21.16 47.39,19.84 arc2 47.38,19.8 46.89,16.91 arc10 46.89,16.81 46.89,15.41 arc1 46.89,15.4 47.08,6.56 47.08,6.46 U2.3 | v41.8,23.27 42.27,23.27 42.36,23.27 U3.5 44.97,23.04 45.06,23.04 arc-36 45.12,23.02 47.67,21.16
  BOTTOM 0.191: v41.8,23.27 41.27,23.32 arc-6 41.21,23.33 U1.1_7
N$1
  TOP 0.254: L2.1 93.98,8.89 93.98,8.76 93.98,7.28 93.98,7.15 R5.2
N$2
  TOP 0.254: L4.1 93.98,36.83 93.98,36.96 93.98,38.44 93.98,38.57 R10.2
N$3
  TOP 0.191: U1.1_13 U1.13* U1.13 U1.13_
  BOTTOM 0.191: SJ13.1 15.14,36.48 15.05,36.48 arc-9 15.03,36.48 14.43,37.08 8.13,37.08 6.99,38.23 U1.13_
N$4
  TOP 0.191: C21.1 72.17,25.12 72.17,25.03 72.17,24 72.17,23.9 C20.1 71.72,23.09 71.62,23.09 arc24 71.59,23.08 69.69,22.23 U4.17
N$5
  TOP 0.191: 61.83,13.86 61.25,13.58 arc-25 61.21,13.57 61.11,13.57 C23.1 60.3,12.66 60.3,12.57 arc-26 60.29,12.53 Y1.1 | U4.2 66.69,17.14 66.53,16.9 arc-40 66.3,16.74 62.17,15.62 arc69 61.98,15.39 61.83,13.86 | R23.2 62.33,13.57 62.24,13.57 arc-38 62.18,13.6 61.83,13.86
N$6
  TOP 0.191: Y1.2 63.5,14.32 | 63.5,14.32 64.26,14.37 64.27,14.37 64.36,14.37 C22.1 65.17,15.28 65.27,15.28 arc44 65.34,15.3 66.42,16.34 arc-9 66.48,16.4 66.64,16.51 arc10 66.74,16.6 66.99,16.85 arc10 67.03,16.9 67.19,17.14 U4.3 | R23.1 63.14,14.37 63.24,14.37 arc-10 63.26,14.36 63.5,14.32
N$7
  TOP 0.191: C16.1 67.72,28.23 67.81,28.23 68.84,28.23 68.94,28.23 C19.1 68.94,27.78 68.94,27.68 68.82,25.81 arc-31 68.78,25.68 68.49,25.28 arc35 68.48,25.23 68.48,25.13 C15.1 67.69,24.22 67.69,24.13 67.69,22.23 U4.21
N$8
  TOP 0.254: R7.1 89.03,8.39 89.03,8.52 89.03,11.8 89.03,11.93 R8.2
N$9
  TOP 0.254: R6.1 86.23,3.31 86.23,3.44 86.23,6.72 86.23,6.85 R7.2
N$10
  TOP 0.254: R5.1 93.21,3.11 93.08,3.11 89.83,3.11 89.7,3.11 R6.2
N$11
  TOP 0.254: R12.1 89.03,37.33 89.03,37.2 89.03,33.92 89.03,33.79 R13.2
N$12
  TOP 0.254: R11.1 86.23,42.41 86.23,42.28 86.23,39 86.23,38.87 R12.2
N$13
  TOP 0.254: R10.1 93.21,42.61 93.08,42.61 89.83,42.61 89.7,42.61 R11.2
N$14
  TOP 0.191: C18.1 70.97,27.78 70.97,27.68 70.85,25.81 arc-31 70.81,25.68 70.53,25.28 arc35 70.51,25.23 70.51,25.13 C17.1 69.7,24.22 69.7,24.13 arc-28 69.69,24.08 68.69,22.23 U4.19
N$15
  TOP 0.191: JP4.TIP 80.36,11.89 arc29 80.37,11.94 80.37,12.03 L8.1
N$16
  TOP 0.191: JP3.TIP 69.6,32.75 arc77 69.86,32.55 70.86,32.55 arc67 71.1,32.71 71.65,34.01 arc-67 71.89,34.17 72.89,34.17 79.24,34.16 arc-19 79.32,34.15 80.24,33.82 arc19 80.27,33.82 80.37,33.82 L6.1
N$17
  TOP 0.191: JP3.SLEEVE 72.47,36.62 arc-17 72.32,36.24 70.94,33.86 arc-60 70.86,33.82 70.76,33.82 L5.1
N$18
  TOP 0.191: JP4.SLEEVE 72.47,9.1 arc16 72.33,9.46 70.94,11.98 arc61 70.86,12.03 70.76,12.03 L7.1
N$19
  TOP 0.191: C14.1 59.05,20 59.15,20 arc-17 59.17,20 60.12,19.71 arc17 60.2,19.7 61.3,19.7 arc35 61.44,19.74 61.84,20.02 arc-35 61.9,20.04 61.99,20.04 C12.1 | C13.1 62.45,22.07 62.45,21.98 62.45,20.95 62.45,20.85 C12.1 | C12.1 62.9,20.43 62.99,20.43 65.39,20.43 U4.27
N$20
  TOP 0.191: U1.23_ 6.78,13.08 U1.23 4.65,13.08 U1.23* U1.1_23
N$21
  TOP 0.254: C1.+ 35.75,30.09 arc29 35.69,30.11 35.56,30.11 R3.1 | C1.+ | C1.+
  BOTTOM 0.254: C1.+ 38.65,28.51 38.61,28.51
N$22
  TOP 0.191: U1.1_15 U1.15* 4.65,33.4 U1.15 6.78,33.4 U1.15_
  BOTTOM 0.191: SJ11.1 10.7,33.4 10.6,33.4 U1.15_
N$23
  TOP 0.191: U1.11_ 24.97,35.94 U1.11 27.1,35.94 U1.11* U1.1_11
  BOTTOM 0.191: 32.83,35.94 U1.1_11
  BOTTOM 0.203: SJ4.2 32.83,35.94
N$25
  TOP 0.191: U1.1_10 U1.10* 27.1,33.4 U1.10 24.97,33.4 U1.10_
  BOTTOM 0.191: 32.83,33.4 U1.1_10
  BOTTOM 0.203: SJ3.2 32.83,33.4
N$27
  TOP 0.191: U1.6_ 24.97,23.24 U1.6 27.1,23.24 U1.6* U1.1_6
  BOTTOM 0.191: 32.83,23.24 U1.1_6
  BOTTOM 0.254: 32.83,23.24 SJ2.2
N$28
  TOP 0.191: U1.1_5 U1.5* 27.1,20.7 U1.5 24.97,20.7 U1.5_
  BOTTOM 0.191: 32.83,20.7 U1.1_5
  BOTTOM 0.203: SJ1.2 32.83,20.7
N$29
  TOP 0.191: U1.1_20 U1.20* 4.65,20.7 U1.20 6.78,20.7 U1.20_
  BOTTOM 0.191: SJ6.1 10.7,20.7 10.6,20.7 U1.20_
N$30
  TOP 0.191: U1.19_ 6.78,23.24 U1.19 4.65,23.24 U1.19* U1.1_19
  BOTTOM 0.191: SJ7.1 10.7,23.24 10.6,23.24 U1.19_
N$31
  TOP 0.191: U1.1_18 U1.18* 4.65,25.78 U1.18 6.78,25.78 U1.18_
  BOTTOM 0.191: SJ8.1 10.7,25.78 10.6,25.78 U1.18_
N$32
  TOP 0.191: U1.17_ 6.78,28.32 U1.17 4.65,28.32 U1.17* U1.1_17
  BOTTOM 0.191: SJ9.1 10.7,28.32 10.6,28.32 U1.17_
N$34
  TOP 0.191: U1.1_14 U1.14* 4.65,35.94 U1.14 6.78,35.94 U1.14_
  BOTTOM 0.191: SJ12.1 10.7,35.94 10.6,35.94 U1.14_
N$35
  TOP 0.191: U1.1_16 U1.16* 4.65,30.86 U1.16 6.78,30.86 U1.16_
  BOTTOM 0.191: SJ10.1 10.7,30.86 10.6,30.86 U1.16_
N$37
  TOP 0.191: R3.2 32.98,30.07 32.89,30.07 arc81 32.8,30 32.63,28.99 arc9 32.63,28.95 32.63,24.61 32.63,24.51 D1.C 32.72,23.75 32.72,23.66 32.72,22.19 32.72,22.1 D2.A
N$38
  TOP 0.191: U1.12_ 24.97,38.48 U1.12 27.1,38.48 U1.12* U1.1_12
  BOTTOM 0.191: SJ5.2 32.92,38.48 32.83,38.48 U1.1_12
PWR_CS  (via drill 0.3 pad 0.61)
  TOP 0.191: U4.29 65.39,19.43 65.16,19.27 arc2 65.15,19.27 arc-11 65.05,19.21 v64.06,18.74 63.03,18.32 arc-22 62.99,18.31 62.9,18.31 R21.1
  BOTTOM 0.191: SJ3.1 34.38,32.86 34.38,32.77 arc35 34.4,32.71 37.77,27.88 arc17 37.99,27.64 41.89,24.61 arc-15 42.06,24.44 42.53,23.83 arc-11 42.62,23.68 44.58,19.68 arc60 45.33,19.18 54.94,18.54 arc5 54.99,18.54 v64.06,18.74
PWR_EN  (via drill 0.3 pad 0.61)
  TOP 0.191: v65.83,14.35 66.3,14.37 66.4,14.37 R22.1 67.21,15.12 67.3,15.12 67.89,15.12 arc21 68.09,15.16 69.34,15.65 arc69 69.7,16.18 69.69,17.14 U4.8
  BOTTOM 0.191: SJ6.2 12.16,20.16 12.26,20.16 arc-25 12.3,20.15 24.25,14.53 arc25 24.77,14.42 29.84,14.42 arc10 30.04,14.44 35.63,15.37 arc-11 35.75,15.38 v65.83,14.35
PWR_INT1  (via drill 0.3 pad 0.61)
  TOP 0.191: v67.89,15.69 68.36,16.14 arc33 68.52,16.41 68.69,17.14 U4.6
  BOTTOM 0.191: SJ2.1 34.38,22.7 34.48,22.7 arc-24 34.52,22.69 44.6,18.27 arc19 45.23,18.11 65.17,16.41 arc8 65.3,16.41 66.77,16.5 arc-47 67.2,16.34 v67.89,15.69
PWR_INT2  (via drill 0.3 pad 0.61)
  TOP 0.191: v69.14,16.18 69.19,17.14 U4.7
  BOTTOM 0.191: SJ1.1 34.38,20.16 34.48,20.16 arc-15 34.51,20.16 44.71,17.48 arc9 45.13,17.41 67.83,15.12 arc52 68.3,15.3 v69.14,16.18
PWR_LED1  (via drill 0.3 pad 0.61)
  TOP 0.191: v66.81,15.94 67.52,16.88 | 67.52,16.88 | 67.52,16.88 67.52,16.89 arc2 67.53,16.9 67.69,17.14 U4.4
  BOTTOM 0.191: SJ9.2 12.16,27.78 12.26,27.78 arc-25 12.3,27.77 24.25,22.15 arc24 24.73,22.04 29.88,21.9 arc-2 29.92,21.9 34.5,21.6 arc-16 34.57,21.58 44.59,17.89 arc15 45.2,17.76 65.14,16.06 arc1 65.15,16.06 v66.81,15.94
PWR_LED2  (via drill 0.3 pad 0.61)
  TOP 0.191: v67.97,16.55 68.19,17.14 U4.5
  BOTTOM 0.191: SJ10.2 12.16,30.32 12.26,30.32 arc-25 12.3,30.31 24.25,24.69 arc24 24.73,24.58 29.88,24.44 arc-2 29.92,24.44 34.5,24.14 arc-25 34.6,24.11 44.62,18.66 arc24 45.26,18.47 65.2,16.77 arc8 65.28,16.77 66.75,16.86 arc-20 67.08,16.82 v67.97,16.55
PWR_SYN  (via drill 0.3 pad 0.61)
  TOP 0.191: v64.81,19.72 65.39,19.93 U4.28
  BOTTOM 0.191: SJ7.2 12.16,22.7 12.26,22.7 arc-25 12.3,22.69 24.25,17.07 arc24 24.73,16.96 29.88,16.82 arc-1 29.91,16.82 65.86,14.91 arc-1 65.87,14.91 67.82,14.77 arc41 68.44,14.95 69.47,15.72 arc124 69.32,16.71 66.28,17.76 arc-36 66.07,17.92 v64.81,19.72
PWR_ZCR  (via drill 0.3 pad 0.61)
  TOP 0.191: v65.25,17.33 U4.1
  BOTTOM 0.191: SJ13.2 16.61,35.4 16.7,35.4 arc-22 16.74,35.39 24.31,32.29 arc21 24.73,32.2 29.88,32.06 arc-32 30.52,31.86 41.64,24.36 arc-19 41.78,24.23 42.24,23.61 arc-11 42.3,23.52 44.26,19.53 arc60 45.3,18.82 v65.25,17.33
UART_RX
  TOP 0.191: U1.4_ 24.97,18.16 U1.4 27.1,18.16 U1.4* U1.1_4
UART_TX
  TOP 0.191: U1.3_ 24.97,15.62 U1.3 27.1,15.62 U1.3* U1.1_3
USD_CD  (via drill 0.3 pad 0.61)
  TOP 0.191: U2.CD1 41.88,16.71 41.79,16.71 arc-13 41.77,16.72 v37.92,17.58
  BOTTOM 0.191: v37.92,17.58 30.11,19.33 arc11 29.88,19.36 24.73,19.5 arc-24 24.25,19.61 12.3,25.23 arc25 12.26,25.24 12.16,25.24 SJ8.2
USD_CS  (via drill 0.3 pad 0.61)
  TOP 0.191: U2.2 48.17,6.87 48.17,6.96 arc6 48.17,6.97 47.24,15.38 arc-6 47.24,15.41 47.24,16.81 arc-10 47.24,16.85 47.73,19.75 arc-20 47.8,19.93 v48.32,20.86 | R2.2 33.9,28.85 33.9,28.95 arc-20 33.9,28.98 34.23,29.89 arc15 34.25,29.96 34.34,31 v34.94,37.19
  BOTTOM 0.191: SJ5.1 34.38,37.94 34.38,37.85 arc41 34.41,37.78 v34.94,37.19 v48.32,20.86
VBAT  (via drill 0.3 pad 0.61)
  TOP 0.191: U1.1_22 U1.22* 4.65,15.62 U1.22 6.78,15.62 U1.22_ 8.04,13.65 arc-28 8.19,13.08 8.19,3.67 8.19,3.58 C2.1 | D2.C 35.73,21.34 35.73,21.24 v35.73,14.81
  BOTTOM 0.191: v35.73,14.81 30.39,12.03 arc-28 29.84,11.89 24.77,11.89 arc-12 24.52,11.92 U1.22_
VDD
  TOP 0.254: C8.1 63.51,28.66 63.38,28.66 60.01,28.66 59.88,28.66 C11.1 59.23,28.51 59.23,28.38 59.23,25.9 59.23,25.77 L1.2 | L1.2 59.69,25.04 59.82,25.04 62.11,25.04 62.24,25.04 C10.1 62.98,24.68 63.11,24.68 64.14,24.68 64.27,24.68 C9.1 65.02,24.25 65.02,24.13 arc44 65.05,24.04 66.5,22.53 arc-13 66.56,22.45 66.69,22.23 U4.23 | R21.2 60.32,18.28 60.2,18.28 arc-31 60.13,18.3 57.8,19.67 arc-59 57.67,19.91 57.64,21.7 57.64,21.71 57.64,22.51 arc-28 57.68,22.65 58.83,24.84 arc28 58.85,24.9 58.85,25.03 L1.2
VIN1+  (via drill 0.3 pad 0.61)
  TOP 0.191: R8.1 85.53,13.51 85.53,13.6 85.53,13.61 85.12,19.81 85.12,19.82 85.12,19.91 R9.2 84.22,20.73 84.12,20.73 arc-35 84.07,20.74 83.66,21.02 arc35 83.52,21.07 80.51,21.07 80.42,21.07 C4.1 79.61,20.71 79.51,20.71 arc21 79.48,20.71 v76.61,19.62
  TOP 0.203: U4.9 70.45,17.78 v71.75,17.78
  BOTTOM 0.191: v71.75,17.78 v76.61,19.62
VIN2+  (via drill 0.3 pad 0.61)
  TOP 0.191: R13.1 85.53,32.22 85.53,32.12 85.53,32.11 85.12,25.91 85.12,25.9 85.12,25.8 R14.2 84.22,25 84.12,25 arc35 84.07,24.98 83.66,24.7 arc-35 83.52,24.65 80.51,24.65 80.42,24.65 C5.1 79.61,24.09 79.51,24.09 arc18 79.48,24.09 v77.64,23.5
  TOP 0.203: U4.16 70.45,21.59 v71.75,21.59
  BOTTOM 0.191: v71.75,21.59 v77.64,23.5

### Text on the board
Dimension: CUT OUT | CUT OUT
tPlace: Current 2 | AC Line 2 | 1.5 F | 82µF | 1N5819 | STPM34 | AC Neutral | SPI Flash | 16MHz | Current 1 | AC Line 1
bPlace: Power Meter v0.6d / 2016 Daniel Sullivan / CC BY-SA 4.0 / mumblepins.github.io | CAUTION: HIGH VOLTAGE | L1-L8 / / C22-23 / C9, C12, C15, C17, C20 / C6-7 / C4-5 / C2, C3, C10, C13, C16, C18, C21 / C8, C19 / C14 / / R15, R16 / R3 / R9, R14, R17-20 / R1, R2, R4, R21, R22 / R5-8, R10-13 / R23 | 1500 Ω Ind. / / 15 pF / 150 pF / 10 nF / 22 nF / 100 nF / 1 µF / 4.7 µF / / 3 Ω / 120 Ω / 1 kΩ / 10 kΩ / 422 kΩ / 1 MΩ
bNames: Flash Hold | µSD CS | Pwr ZCr | Flash CS | Flash WP | Pwr CS | Pwr LED2 | Pwr LED1 | µSD CD | Pwr Syn | Pwr INT1 | Pwr Enable | Pwr INT2